# EAGLE design YM5214Emu (EAGLE 7.5.0)
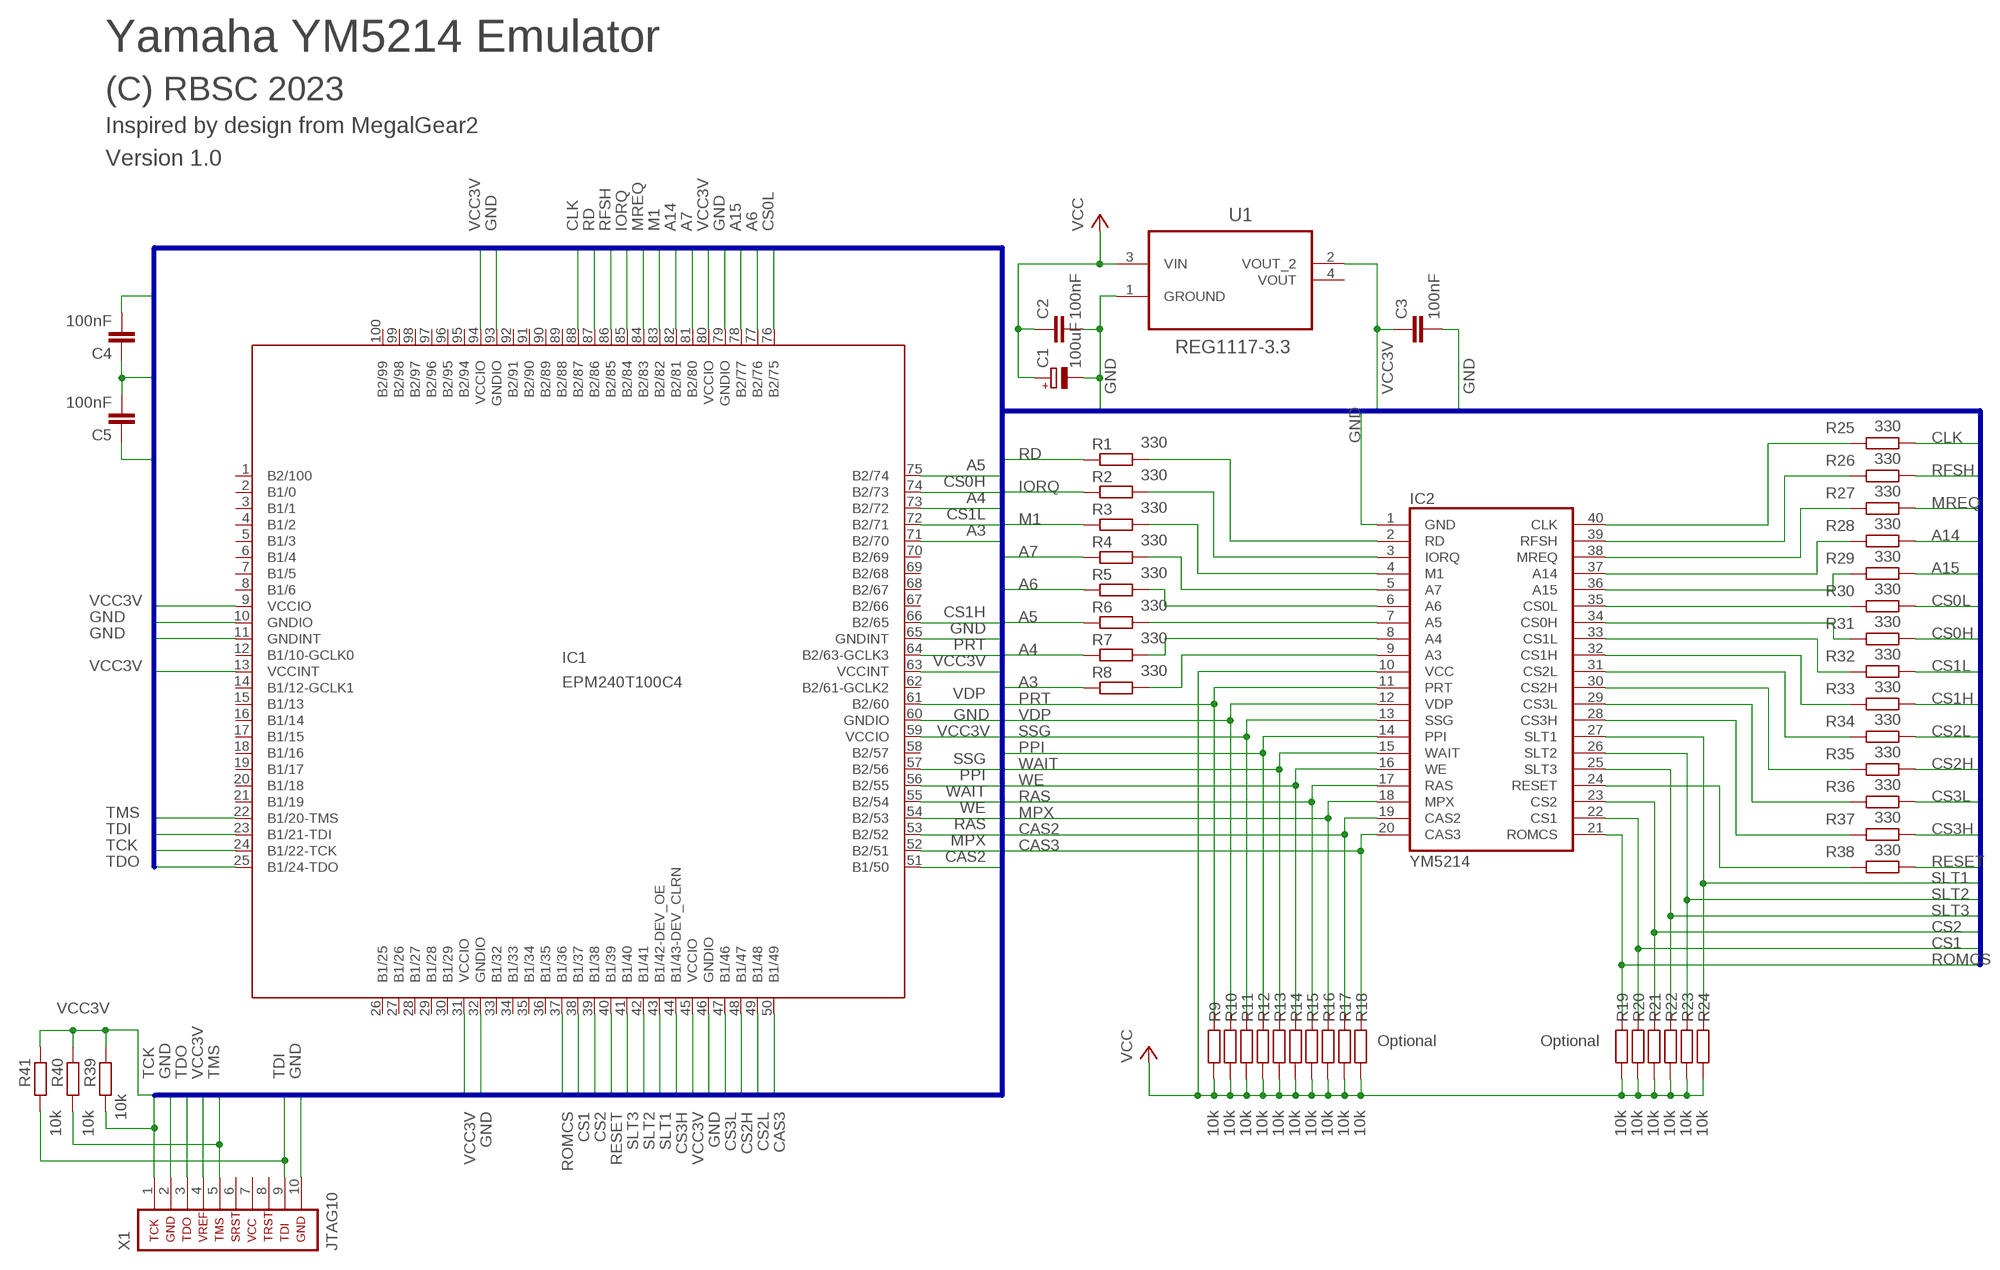
[diagram p0: schematic, sheet 1]

## Parts
C1  100uF  CPOL-EUSMCD  [SMC_D]
C2  100nF  C-EUC0805  [C0805]
C3  100nF  C-EUC0805  [C0805]
C4  100nF  C-EUC0805  [C0805]
C5  100nF  C-EUC0805  [C0805]
IC1  EPM240T100C4  [TQFP100]
IC2  YM5214  [DIL40]
R1  330  R-EU_R0805  [R0805]
R2  330  R-EU_R0805  [R0805]
R3  330  R-EU_R0805  [R0805]
R4  330  R-EU_R0805  [R0805]
R5  330  R-EU_R0805  [R0805]
R6  330  R-EU_R0805  [R0805]
R7  330  R-EU_R0805  [R0805]
R8  330  R-EU_R0805  [R0805]
R9  10k  R-EU_R0805  [R0805]
R10  10k  R-EU_R0805  [R0805]
R11  10k  R-EU_R0805  [R0805]
R12  10k  R-EU_R0805  [R0805]
R13  10k  R-EU_R0805  [R0805]
R14  10k  R-EU_R0805  [R0805]
R15  10k  R-EU_R0805  [R0805]
R16  10k  R-EU_R0805  [R0805]
R17  10k  R-EU_R0805  [R0805]
R18  10k  R-EU_R0805  [R0805]
R19  10k  R-EU_R0805  [R0805]
R20  10k  R-EU_R0805  [R0805]
R21  10k  R-EU_R0805  [R0805]
R22  10k  R-EU_R0805  [R0805]
R23  10k  R-EU_R0805  [R0805]
R24  10k  R-EU_R0805  [R0805]
R25  330  R-EU_R0805  [R0805]
R26  330  R-EU_R0805  [R0805]
R27  330  R-EU_R0805  [R0805]
R28  330  R-EU_R0805  [R0805]
R29  330  R-EU_R0805  [R0805]
R30  330  R-EU_R0805  [R0805]
R31  330  R-EU_R0805  [R0805]
R32  330  R-EU_R0805  [R0805]
R33  330  R-EU_R0805  [R0805]
R34  330  R-EU_R0805  [R0805]
R35  330  R-EU_R0805  [R0805]
R36  330  R-EU_R0805  [R0805]
R37  330  R-EU_R0805  [R0805]
R38  330  R-EU_R0805  [R0805]
R39  10k  R-EU_R0805  [R0805]
R40  10k  R-EU_R0805  [R0805]
R41  10k  R-EU_R0805  [R0805]
U1  REG1117-3.3  [SOT230P700X180-4N]
X1  JTAG10  [JTAG10]

## Nets
A3: IC1.71(B2/70) R8.1
A4: IC1.73(B2/72) R7.1
A5: IC1.75(B2/74) R6.1
A6: IC1.77(B2/76) R5.1
A7: IC1.81(B2/80) R4.1
A14: IC1.82(B2/81) R28.2
A15: IC1.78(B2/77) R29.2
CAS2: IC1.51(B1/50) IC2.19(CAS2) R17.2
CAS3: IC1.50(B1/49) IC2.20(CAS3) R18.2
CLK: IC1.88(B2/87) R25.2
CS0H: IC1.74(B2/73) R31.2
CS0L: IC1.76(B2/75) R30.2
CS1: IC1.38(B1/37) IC2.22(CS1) R20.2
CS1H: IC1.66(B2/65) R33.2
CS1L: IC1.72(B2/71) R32.2
CS2: IC1.39(B1/38) IC2.23(CS2) R21.2
CS2H: IC1.48(B1/47) R35.2
CS2L: IC1.49(B1/48) R34.2
CS3H: IC1.44(B1/43-DEV_CLRN) R37.2
CS3L: IC1.47(B1/46) R36.2
GND: C1.- C2.2 C3.2 C4.1 C5.2 IC1.10(GNDIO) IC1.11(GNDINT) IC1.32(GNDIO) IC1.46(GNDIO) IC1.60(GNDIO) IC1.65(GNDINT) IC1.79(GNDIO) IC1.93(GNDIO) IC2.1(GND) U1.1(GROUND) X1.2 X1.10
IORQ: IC1.85(B2/84) R2.1
M1: IC1.83(B2/82) R3.1
MPX: IC1.52(B2/51) IC2.18(MPX) R16.2
MREQ: IC1.84(B2/83) R27.2
N$1: IC2.2(RD) R1.2
N$2: IC2.3(IORQ) R2.2
N$3: IC2.4(M1) R3.2
N$5: IC2.5(A7) R4.2
N$6: IC2.6(A6) R5.2
N$7: IC2.7(A5) R6.2
N$8: IC2.8(A4) R7.2
N$9: IC2.9(A3) R8.2
N$10: IC2.24(RESET) R38.1
N$11: IC2.28(CS3H) R37.1
N$12: IC2.29(CS3L) R36.1
N$13: IC2.30(CS2H) R35.1
N$14: IC2.31(CS2L) R34.1
N$15: IC2.32(CS1H) R33.1
N$16: IC2.33(CS1L) R32.1
N$17: IC2.34(CS0H) R31.1
N$18: IC2.35(CS0L) R30.1
N$19: IC2.36(A15) R29.1
N$20: IC2.37(A14) R28.1
N$21: IC2.38(MREQ) R27.1
N$22: IC2.39(RFSH) R26.1
N$23: IC2.40(CLK) R25.1
PPI: IC1.56(B2/55) IC2.14(PPI) R12.2
PRT: IC1.64(B2/63-GCLK3) IC2.11(PRT) R9.2
RAS: IC1.53(B2/52) IC2.17(RAS) R15.2
RD: IC1.87(B2/86) R1.1
RESET: IC1.40(B1/39) R38.2
RFSH: IC1.86(B2/85) R26.2
ROMCS: IC1.37(B1/36) IC2.21(ROMCS) R19.2
SLT1: IC1.43(B1/42-DEV_OE) IC2.27(SLT1) R24.2
SLT2: IC1.42(B1/41) IC2.26(SLT2) R23.2
SLT3: IC1.41(B1/40) IC2.25(SLT3) R22.2
SSG: IC1.57(B2/56) IC2.13(SSG) R11.2
TCK: IC1.24(B1/22-TCK) R39.1 X1.1
TDI: IC1.23(B1/21-TDI) R41.1 X1.9
TDO: IC1.25(B1/24-TDO) X1.3
TMS: IC1.22(B1/20-TMS) R40.1 X1.5
VCC: C1.+ C2.1 IC2.10(VCC) R9.1 R10.1 R11.1 R12.1 R13.1 R14.1 R15.1 R16.1 R17.1 R18.1 R19.1 R20.1 R21.1 R22.1 R23.1 R24.1 U1.3(VIN)
VCC3V: C3.1 C4.2 C5.1 IC1.9(VCCIO) IC1.13(VCCINT) IC1.31(VCCIO) IC1.45(VCCIO) IC1.59(VCCIO) IC1.63(VCCINT) IC1.80(VCCIO) IC1.94(VCCIO) R39.2 R40.2 R41.2 U1.2(VOUT_2) X1.4
VDP: IC1.61(B2/60) IC2.12(VDP) R10.2
WAIT: IC1.55(B2/54) IC2.15(WAIT) R13.2
WE: IC1.54(B2/53) IC2.16(WE) R14.2
Unconnected: IC1.1(B2/100) IC1.2(B1/0) IC1.3(B1/1) IC1.4(B1/2) IC1.5(B1/3) IC1.6(B1/4) IC1.7(B1/5) IC1.8(B1/6) IC1.12(B1/10-GCLK0) IC1.14(B1/12-GCLK1) IC1.15(B1/13) IC1.16(B1/14) IC1.17(B1/15) IC1.18(B1/16) IC1.19(B1/17) IC1.20(B1/18) IC1.21(B1/19) IC1.26(B1/25) IC1.27(B1/26) IC1.28(B1/27) IC1.29(B1/28) IC1.30(B1/29) IC1.33(B1/32) IC1.34(B1/33) IC1.35(B1/34) IC1.36(B1/35) IC1.58(B2/57) IC1.62(B2/61-GCLK2) IC1.67(B2/66) IC1.68(B2/67) IC1.69(B2/68) IC1.70(B2/69) IC1.89(B2/88) IC1.90(B2/89) IC1.91(B2/90) IC1.92(B2/91) IC1.95(B2/94) IC1.96(B2/95) IC1.97(B2/96) IC1.98(B2/97) IC1.99(B2/98) IC1.100(B2/99) U1.4(VOUT) X1.6 X1.7 X1.8

## Buses
RD,IORQ,M1,A7,A6,A5,A4,A3,CLK,RFSH,MREQ,A14,A15,CS0L,CS0H,CS1L,CS1H,CS2L,CS2H,CS3L,CS3H,RESET,VCC3V,GND,VCC,TMS,TDO,TDI,TCK,PRT,VDP,SSG,PPI,WAIT,WE,RAS,MPX,CAS2,CAS3,ROMCS,CS1,CS2,SLT1,SLT2,SLT3

## Notes on the sheet
- Yamaha YM5214 Emulator
- (C) RBSC 2023
- Inspired by design from MegalGear2
- Version 1.0
- Optional | Optional

## Library data of the parts
C1 = resistor:CPOL-EU: POLARIZED CAPACITOR, European symbol
C2-C5 = rcl:C-EU: CAPACITOR, European symbol
IC1 = altera:EPM240T100C4: EPM240T100 Low-cost, low-power CPLD Auto generated by make-symbol-device-package-bsdl.ulp Rev. 35 Source: www.altera.com .. epm240-io.txt; MPN: EPM240T100C4; OC_FARNELL: 1453502; OC_NEWARK: 51R9357
IC2 = ym5214:YM5214: YM5214
R1-R41 = rcl:R-EU_: RESISTOR, European symbol
U1 = Texas Instruments_By_element14_Batch_1:REG1117-3.3: Low Dropout Positive Regulator; MPN: REG1117-3.3; OC_FARNELL: 1212355; OC_NEWARK: 35C1963; PACKAGE: SOT-223-4; SUPPLIER: Texas Instruments
X1 = JTAG:JTAG10: AVR JTAG Debug/Programming Header

## Board
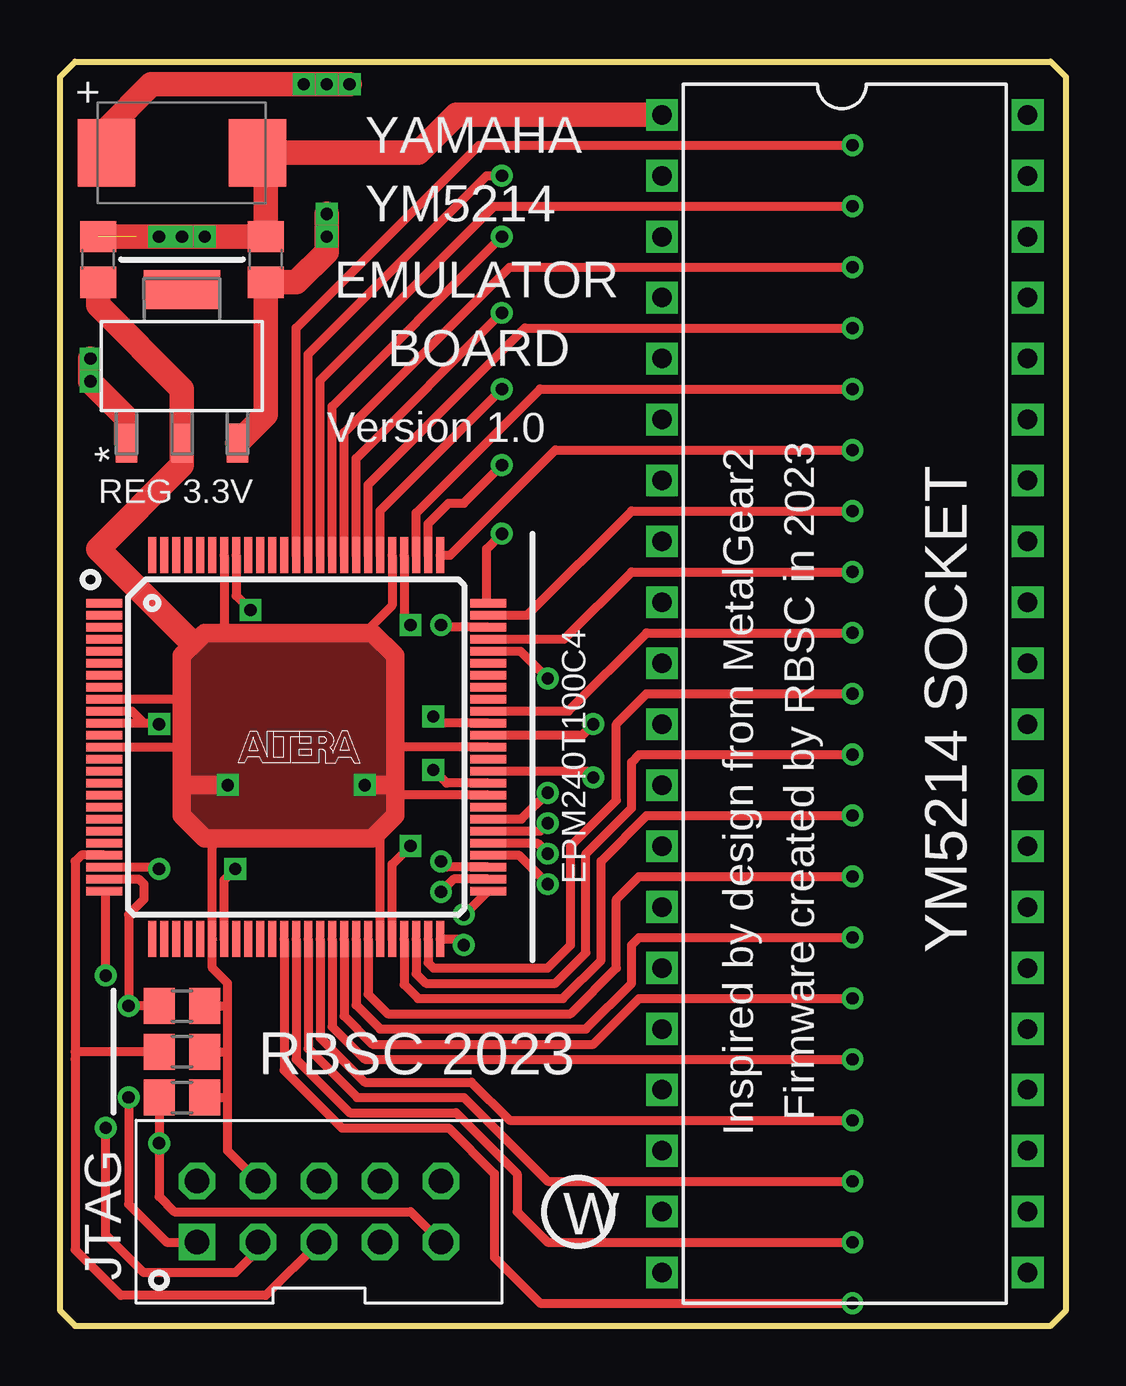
[diagram p1: board, top side]
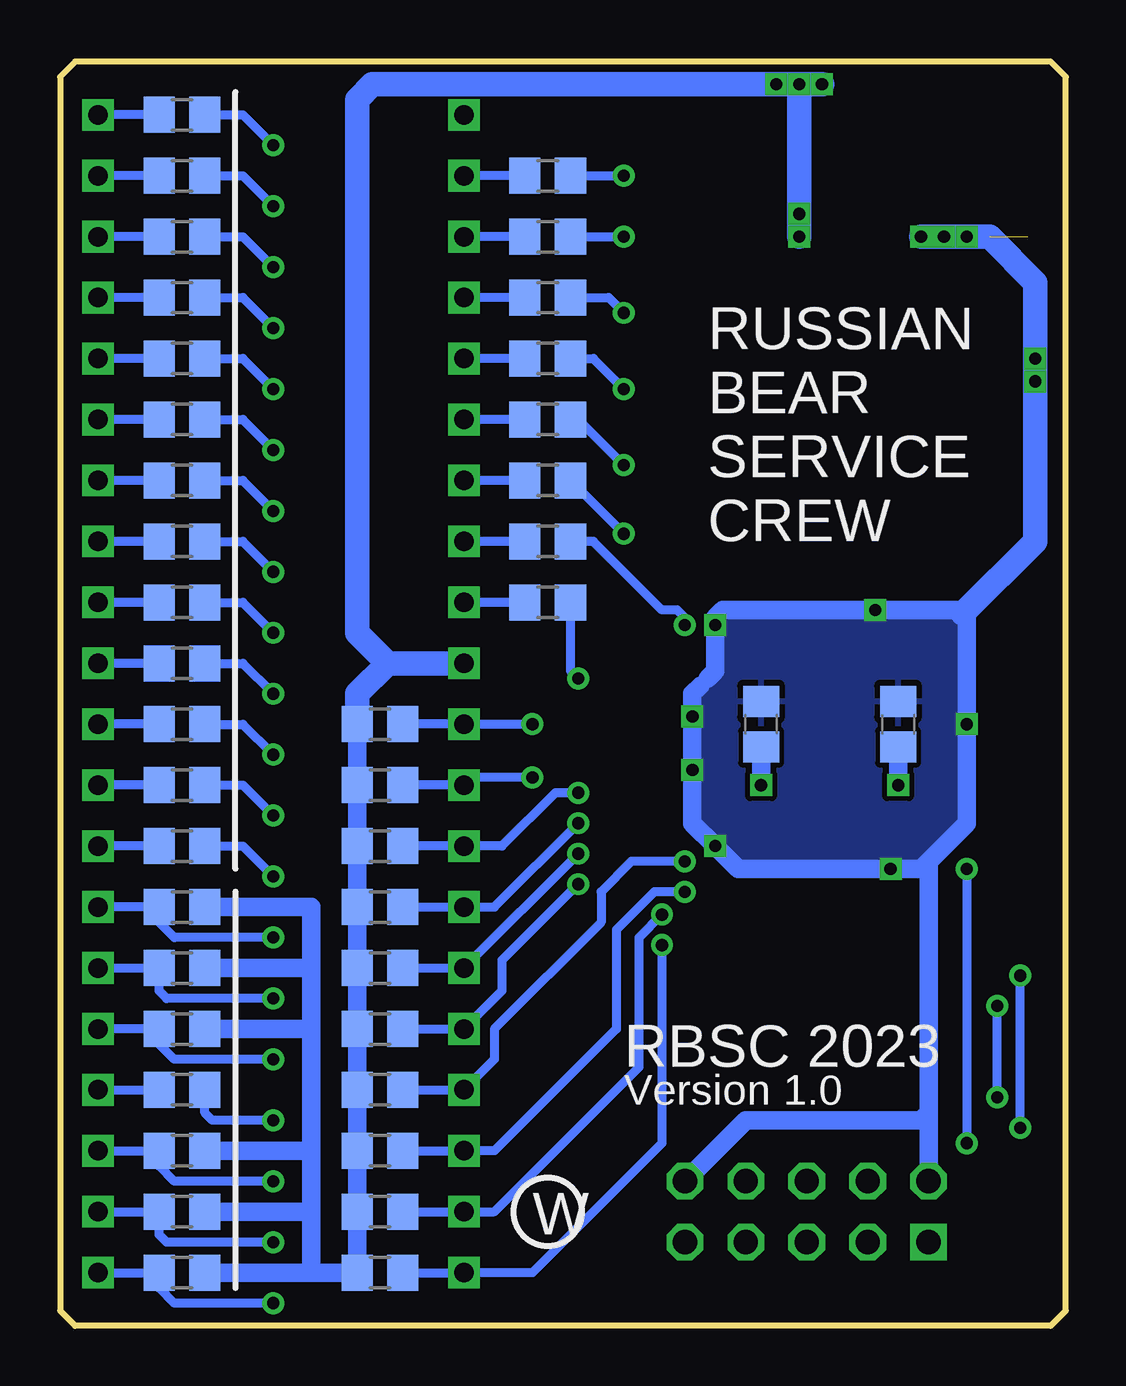
[diagram p2: board, bottom side, seen from below]

Size 41.91 x 52.7 mm. Coordinates in mm from the lower left corner, seen from the top.
Outline: 0,0.64 0,52.07 0.64,52.7 41.27,52.7 41.91,52.07 41.91,0.64 41.27,0 0.64,0 0,0.64
Copper layers (1*16): Top 0.035mm / dielectric 1.5mm / Bottom 0.035mm
Design rules "default *": minimum track width 10mil, minimum drill 24mil, track to track 8mil, track to pad 8mil, pad to pad 8mil, via to via 8mil, smd to smd 8mil, copper to edge 8mil, drill to drill 8mil, minimum pad ring 10mil, minimum via ring 8mil, stop-mask expansion 4mil, vias tented up to drill 24mil, thermal gap 10mil

### Footprints (pad centres in the part's own frame; a part is rotated, then mirrored left to right if it is on the bottom)
SMC_D = smd 2.4 x 2.8: + -3.15,0; - 3.15,0
C0805 = smd 1.3 x 1.5: 1 -0.95,0; 2 0.95,0
TQFP100 = smd 1.5 x 0.35: 1 -8,6; 2 -8,5.5; 3 -8,5; 4 -8,4.5; 5 -8,4; 6 -8,3.5; 7 -8,3; 8 -8,2.5; 9 -8,2; 10 -8,1.5; 11 -8,1; 12 -8,0.5; 13 -8,0; 14 -8,-0.5; 15 -8,-1; 16 -8,-1.5; 17 -8,-2; 18 -8,-2.5; 19 -8,-3; 20 -8,-3.5; 21 -8,-4; 22 -8,-4.5; 23 -8,-5; 24 -8,-5.5; 25 -8,-6; 51 8,-6; 52 8,-5.5; 53 8,-5; 54 8,-4.5; 55 8,-4; 56 8,-3.5; 57 8,-3; 58 8,-2.5; 59 8,-2; 60 8,-1.5; 61 8,-1; 62 8,-0.5; 63 8,0; 64 8,0.5; 65 8,1; 66 8,1.5; 67 8,2; 68 8,2.5; 69 8,3; 70 8,3.5; 71 8,4; 72 8,4.5; 73 8,5; 74 8,5.5; 75 8,6 | smd 0.35 x 1.5: 26 -6,-8; 27 -5.5,-8; 28 -5,-8; 29 -4.5,-8; 30 -4,-8; 31 -3.5,-8; 32 -3,-8; 33 -2.5,-8; 34 -2,-8; 35 -1.5,-8; 36 -1,-8; 37 -0.5,-8; 38 0,-8; 39 0.5,-8; 40 1,-8; 41 1.5,-8; 42 2,-8; 43 2.5,-8; 44 3,-8; 45 3.5,-8; 46 4,-8; 47 4.5,-8; 48 5,-8; 49 5.5,-8; 50 6,-8; 76 6,8; 77 5.5,8; 78 5,8; 79 4.5,8; 80 4,8; 81 3.5,8; 82 3,8; 83 2.5,8; 84 2,8; 85 1.5,8; 86 1,8; 87 0.5,8; 88 0,8; 89 -0.5,8; 90 -1,8; 91 -1.5,8; 92 -2,8; 93 -2.5,8; 94 -3,8; 95 -3.5,8; 96 -4,8; 97 -4.5,8; 98 -5,8; 99 -5.5,8; 100 -6,8
DIL40 = drill 0.813 square: 1 -24.13,-7.62; 2 -21.59,-7.62; 3 -19.05,-7.62; 4 -16.51,-7.62; 5 -13.97,-7.62; 6 -11.43,-7.62; 7 -8.89,-7.62; 8 -6.35,-7.62; 9 -3.81,-7.62; 10 -1.27,-7.62; 11 1.27,-7.62; 12 3.81,-7.62; 13 6.35,-7.62; 14 8.89,-7.62; 15 11.43,-7.62; 16 13.97,-7.62; 17 16.51,-7.62; 18 19.05,-7.62; 19 21.59,-7.62; 20 24.13,-7.62; 21 24.13,7.62; 22 21.59,7.62; 23 19.05,7.62; 24 16.51,7.62; 25 13.97,7.62; 26 11.43,7.62; 27 8.89,7.62; 28 6.35,7.62; 29 3.81,7.62; 30 1.27,7.62; 31 -1.27,7.62; 32 -3.81,7.62; 33 -6.35,7.62; 34 -8.89,7.62; 35 -11.43,7.62; 36 -13.97,7.62; 37 -16.51,7.62; 38 -19.05,7.62; 39 -21.59,7.62; 40 -24.13,7.62
R0805 = smd 1.3 x 1.5: 1 -0.95,0; 2 0.95,0
SOT230P700X180-4N = smd 1.626 x 0.889: 1 -3.2,2.311; 2 -3.2,0; 3 -3.2,-2.311 | smd 1.626 x 3.175: 4 3.2,0
JTAG10 = drill 1.016 square: 1 -5.08,-1.27 | drill 1.016 octagon: 2 -5.08,1.27; 3 -2.54,-1.27; 4 -2.54,1.27; 5 0,-1.27; 6 0,1.27; 7 2.54,-1.27; 8 2.54,1.27; 9 5.08,-1.27; 10 5.08,1.27

### Placement (x,y rotation side)
C1  5.08,48.9 0 top
C2  8.57,44.45 90 top
C3  1.59,44.45 90 top
C4  6.99,25.08 270 bottom
C5  12.7,25.08 90 bottom
IC1  9.84,24.13 0 top
IC2  32.7,26.35 270 top
R1  21.59,47.94 180 bottom
R2  21.59,45.4 180 bottom
R3  21.59,42.86 180 bottom
R4  21.59,40.32 180 bottom
R5  21.59,37.78 180 bottom
R6  21.59,35.24 180 bottom
R7  21.59,32.7 180 bottom
R8  21.59,30.16 180 bottom
R9  28.57,25.08 0 bottom
R10  28.57,22.54 0 bottom
R11  28.57,20 0 bottom
R12  28.57,17.46 0 bottom
R13  28.57,14.92 0 bottom
R14  28.57,12.38 0 bottom
R15  28.57,9.84 0 bottom
R16  28.57,7.3 0 bottom
R17  28.57,4.76 0 bottom
R18  28.57,2.22 0 bottom
R19  36.83,2.22 180 bottom
R20  36.83,4.76 180 bottom
R21  36.83,7.3 180 bottom
R22  36.83,12.38 180 bottom
R23  36.83,14.92 180 bottom
R24  36.83,17.46 180 bottom
R25  36.83,50.48 0 bottom
R26  36.83,47.94 0 bottom
R27  36.83,45.4 0 bottom
R28  36.83,42.86 0 bottom
R29  36.83,40.32 0 bottom
R30  36.83,37.78 0 bottom
R31  36.83,35.24 0 bottom
R32  36.83,32.7 0 bottom
R33  36.83,30.16 0 bottom
R34  36.83,27.62 0 bottom
R35  36.83,25.08 0 bottom
R36  36.83,22.54 0 bottom
R37  36.83,20 0 bottom
R38  36.83,9.84 0 bottom
R39  5.08,13.34 0 top
R40  5.08,11.43 0 top
R41  5.08,9.53 0 top
U1  5.08,40.01 90 top
X1  10.79,4.76 0 top

### Tracks (layer width: path | path; a pad name or v marks a point on that pad's centre or on a via)
A3  (via drill 0.51)
  Top 0.381: IC1.71 19.18,28.13 v20.32,26.99
  Bottom 0.381: R8.1 20.64,27.31 v20.32,26.99
A4  (via drill 0.51)
  Top 0.381: IC1.73 15.96,29.13 v15.88,29.21
  Bottom 0.381: v15.88,29.21 15.88,29.53 16.19,29.84 16.83,29.84 19.68,32.7 R7.1
A5  (via drill 0.51)
  Top 0.381: IC1.75 17.78,30.19 17.78,32.38 v18.41,33.02
  Bottom 0.381: R6.1 v18.41,33.02
A6  (via drill 0.51)
  Top 0.381: IC1.77 15.34,33.44 16.19,34.29 16.83,34.29 v18.41,35.88
  Bottom 0.381: R5.1 20.32,37.78 v18.41,35.88
A7  (via drill 0.51)
  Top 0.381: IC1.81 13.34,33.98 v18.41,39.05
  Bottom 0.381: R4.1 19.68,40.32 v18.41,39.05
A14  (via drill 0.51)
  Top 0.381: IC1.82 12.84,35.07 19.37,41.59 v33.02,41.59
  Bottom 0.381: R28.2 34.29,42.86 v33.02,41.59
A15  (via drill 0.51)
  Top 0.381: IC1.78 14.84,33.89 20,39.05 v33.02,39.05
  Bottom 0.381: R29.2 34.29,40.32 v33.02,39.05
CAS2  (via drill 0.51)
  Top 0.381: v16.83,17.14 16.86,17.14 IC1.51
  Bottom 0.381: R17.2 IC2.19 23.81,4.76 17.78,10.79 17.78,16.19 v16.83,17.14
CAS3  (via drill 0.51)
  Top 0.381: IC1.50 16.57,16.13 v16.83,15.88
  Bottom 0.381: R18.2 IC2.20 22.23,2.22 16.83,7.62 v16.83,15.88
CLK  (via drill 0.51)
  Top 0.381: IC1.88 9.84,41.59 17.46,49.21 v33.02,49.21
  Bottom 0.381: R25.2 34.29,50.48 v33.02,49.21
CS0H  (via drill 0.51)
  Top 0.381: IC1.74 19.47,29.63 23.81,33.97 v33.02,33.97
  Bottom 0.381: R31.2 34.29,35.24 v33.02,33.97
CS0L  (via drill 0.51)
  Top 0.381: IC1.76 16.25,32.13 20.64,36.51 v33.02,36.51
  Bottom 0.381: R30.2 34.29,37.78 v33.02,36.51
CS1  (via drill 0.51)
  Top 0.381: IC1.38 9.84,11.11 12.06,8.89 16.51,8.89 19.05,6.35 19.05,4.76 20.32,3.49 v33.02,3.49
  Bottom 0.381: IC2.22 R20.2 37.78,3.81 37.47,3.49 v33.02,3.49
CS1H  (via drill 0.51)
  Top 0.381: IC1.66 21.18,25.63 24.45,28.89 v33.02,28.89
  Bottom 0.381: R33.2 34.29,30.16 v33.02,28.89
CS1L  (via drill 0.51)
  Top 0.381: IC1.72 21.01,28.63 23.81,31.43 v33.02,31.43
  Bottom 0.381: R32.2 34.29,32.7 v33.02,31.43
CS2  (via drill 0.51)
  Top 0.381: IC1.39 10.34,11.56 12.38,9.53 16.83,9.53 20.32,6.03 v33.02,6.03
  Bottom 0.381: IC2.23 R21.2 37.78,6.67 37.15,6.03 v33.02,6.03
CS2H  (via drill 0.51)
  Top 0.381: IC1.48 14.84,14.69 15.24,14.29 20.64,14.29 21.91,15.56 21.91,19.68 23.81,21.59 23.81,23.5 24.13,23.81 v33.02,23.81
  Bottom 0.381: R35.2 34.29,25.08 v33.02,23.81
CS2L  (via drill 0.51)
  Top 0.381: IC1.49 15.34,15.14 15.56,14.92 20.32,14.92 21.27,15.88 21.27,20 23.18,21.91 23.18,25.08 24.45,26.35 v33.02,26.35
  Bottom 0.381: R34.2 34.29,27.62 v33.02,26.35
CS3H  (via drill 0.51)
  Top 0.381: IC1.44 12.84,13.83 13.65,13.02 21.27,13.02 23.18,14.92 23.18,17.78 24.13,18.73 v33.02,18.73
  Bottom 0.381: R37.2 34.29,20 v33.02,18.73
CS3L  (via drill 0.51)
  Top 0.381: IC1.47 14.34,14.23 14.92,13.65 20.95,13.65 22.54,15.24 22.54,19.37 24.45,21.27 v33.02,21.27
  Bottom 0.381: R36.2 34.29,22.54 v33.02,21.27
GND  (via drill 0.51)  (1 unrouted)
  Top 0.381: IC1.11 3.49,25.13 | 3.49,25.13 4.08,25.13 v4.13,25.08 | IC1.93 7.34,30.44 v7.94,29.84 | IC1.79 14.34,29.47 v14.61,29.21 | IC1.46 13.84,19.24 v14.61,20 | IC1.32 6.84,18.59 v7.3,19.05 | IC1.10 2.99,25.63 3.49,25.13 | IC1.60 16.11,22.63 v15.56,23.18 | IC1.65 15.83,25.13 v15.56,25.4
  Top 1.016: IC2.1 16.51,50.48 14.92,48.9 C1.- 8.57,48.55 C2.2 C3.2 | U1.1 2.77,37.87 v1.27,39.37 v1.27,40.32
  Bottom 0.381: C5.2
  Bottom 0.762: X1.2 5.71,8.89 | 5.71,8.89 5.71,19.37 | 5.71,19.37 4.13,20.95 v4.13,25.08 4.13,29.53 4.29,29.69 4.45,29.84 v7.94,29.84 14.29,29.84 14.61,29.53 v14.61,29.21 14.61,27.3 14.92,26.99 | 15.24,26.67 15.56,26.35 v15.56,25.4 v15.56,23.18 15.56,20.95 v14.61,20 13.65,19.05 v7.3,19.05 6.03,19.05 5.71,19.37 | X1.10 13.34,8.57 6.03,8.57 5.71,8.89
  Bottom 1.016: 4.29,29.69 1.27,32.7 v1.27,39.37 v1.27,40.32 1.27,43.49 3.17,45.4 6.03,45.4
  pour Bottom: 4.45,29.53 14.61,29.53 14.61,26.67 15.24,26.67 15.24,20.64 14.92,20.64 14.92,20.32 14.61,20.32 14.61,20 14.29,20 14.29,19.37 13.65,19.37 13.65,19.05 5.71,19.05 5.71,19.68 5.08,19.68 5.08,20 4.76,20 4.76,20.64 4.45,20.64
IORQ  (via drill 0.51)
  Top 0.381: IC1.85 11.34,38.33 v18.41,45.4
  Bottom 0.381: R2.1 v18.41,45.4
M1  (via drill 0.51)
  Top 0.381: IC1.83 12.34,36.16 v18.41,42.23
  Bottom 0.381: R3.1 19.05,42.86 v18.41,42.23
MPX  (via drill 0.51)
  Top 0.381: IC1.52 16.41,18.63 v15.88,18.1
  Bottom 0.381: R16.2 IC2.18 23.81,7.3 18.73,12.38 18.73,16.51 17.14,18.1 v15.88,18.1
MREQ  (via drill 0.51)
  Top 0.381: IC1.84 11.84,37.24 18.73,44.13 v33.02,44.13
  Bottom 0.381: R27.2 34.29,45.4 v33.02,44.13
N$1
  Bottom 0.381: R1.2 IC2.2
N$2
  Bottom 0.381: R2.2 IC2.3
N$3
  Bottom 0.381: R3.2 IC2.4
N$5
  Bottom 0.381: R4.2 IC2.5
N$6
  Bottom 0.381: R5.2 IC2.6
N$7
  Bottom 0.381: R6.2 IC2.7
N$8
  Bottom 0.381: R7.2 IC2.8
N$9
  Bottom 0.381: R8.2 IC2.9
N$10
  Bottom 0.381: IC2.24 R38.1
N$11
  Bottom 0.381: R37.1 IC2.28
N$12
  Bottom 0.381: R36.1 IC2.29
N$13
  Bottom 0.381: R35.1 IC2.30
N$14
  Bottom 0.381: R34.1 IC2.31
N$15
  Bottom 0.381: R33.1 IC2.32
N$16
  Bottom 0.381: R32.1 IC2.33
N$17
  Bottom 0.381: R31.1 IC2.34
N$18
  Bottom 0.381: R30.1 IC2.35
N$19
  Bottom 0.381: R29.1 IC2.36
N$20
  Bottom 0.381: R28.1 IC2.37
N$21
  Bottom 0.381: R27.1 IC2.38
N$22
  Bottom 0.381: R26.1 IC2.39
N$23
  Bottom 0.381: R25.1 IC2.40
N$24  (via drill 0.51)
  other vias: 6.03,45.4
N$25  (via drill 0.51)
  other vias: 4.13,45.4
N$26  (via drill 0.51)
  other vias: 5.08,45.4
PPI  (via drill 0.51)
  Top 0.381: IC1.56 20,20.63 v20.32,20.95
  Bottom 0.381: R12.2 IC2.14 23.81,17.46 v20.32,20.95
PRT  (via drill 0.51)
  Top 0.381: IC1.64 21.77,24.63 v22.23,25.08
  Bottom 0.381: R9.2 IC2.11 v22.23,25.08
RAS  (via drill 0.51)
  Top 0.381: IC1.53 16.11,19.13 v15.88,19.37
  Bottom 0.381: R15.2 IC2.17 23.81,11.11 23.81,12.38 19.37,16.83 19.37,18.1 18.1,19.37 v15.88,19.37
RD  (via drill 0.51)
  Top 0.381: IC1.87 10.34,40.51 17.78,47.94 v18.41,47.94
  Bottom 0.381: R1.1 v18.41,47.94
RESET  (via drill 0.51)
  Top 0.381: IC1.40 10.84,12.02 12.7,10.16 17.14,10.16 18.73,8.57 v33.02,8.57
  Bottom 0.381: v33.02,8.57 35.56,8.57 35.88,8.89 R38.2
RFSH  (via drill 0.51)
  Top 0.381: IC1.86 10.84,39.42 18.1,46.67 v33.02,46.67
  Bottom 0.381: R26.2 34.29,47.94 v33.02,46.67
ROMCS  (via drill 0.51)
  Top 0.381: IC1.37 9.34,10.66 11.75,8.26 16.19,8.26 18.1,6.35 18.1,2.86 20,0.95 v33.02,0.95
  Bottom 0.381: IC2.21 R19.2 37.78,1.59 37.15,0.95 v33.02,0.95
SLT1  (via drill 0.51)
  Top 0.381: IC1.43 12.34,13.38 13.34,12.38 21.91,12.38 23.81,14.29 23.81,15.88 24.13,16.19 v33.02,16.19
  Bottom 0.381: IC2.27 R24.2 37.78,16.83 37.15,16.19 v33.02,16.19
SLT2  (via drill 0.51)
  Top 0.381: IC1.42 11.84,12.92 13.02,11.75 22.23,11.75 24.13,13.65 v33.02,13.65
  Bottom 0.381: IC2.26 R23.2 37.78,13.97 37.47,13.65 v33.02,13.65
SLT3  (via drill 0.51)
  Top 0.381: IC1.41 11.34,12.47 12.7,11.11 v33.02,11.11
  Bottom 0.381: IC2.25 R22.2 37.78,11.75 37.15,11.11 v33.02,11.11
SSG  (via drill 0.51)
  Top 0.381: IC1.57 19.23,21.13 v20.32,22.23
  Bottom 0.381: R11.2 IC2.13 23.5,20 21.27,22.23 v20.32,22.23
TCK  (via drill 0.51)
  Top 0.381: IC1.24 3.28,18.63 3.49,18.41 3.49,17.78 2.86,17.14 v2.86,13.34 R39.1 | v2.86,9.53 2.86,5.08 4.45,3.49 X1.1
  Bottom 0.381: v2.86,9.53 v2.86,13.34
TDI  (via drill 0.51)
  Top 0.381: IC1.23 4.05,19.13 v4.13,19.05 | R41.1 v4.13,7.62 4.13,5.4 4.76,4.76 14.61,4.76 X1.9
  Bottom 0.381: v4.13,19.05 v4.13,7.62
TDO  (via drill 0.51)
  Top 0.381: v1.91,8.26 1.91,3.81 3.49,2.22 7.3,2.22 8.26,3.17 X1.3 | v1.91,14.61 1.91,18.07 IC1.25
  Bottom 0.381: v1.91,8.26 v1.91,14.61
TMS
  Top 0.381: IC1.22 0.9,19.63 0.64,19.37 0.64,11.43 | X1.5 8.57,1.27 2.54,1.27 0.64,3.17 0.64,11.11 0.64,11.43 | R40.1 0.64,11.43
VCC  (via drill 0.51)
  Top 1.016: U1.3 8.57,37.99 C2.1 9.85,43.5 11.11,44.77 v11.11,45.4 v11.11,46.35 | C1.+ 1.93,49.87 3.81,51.75 v10.16,51.75 v11.11,51.75 v12.06,51.75
  Bottom 0.762: R9.1 R10.1 R11.1 R12.1 R13.1 R14.1 R15.1 R16.1 R17.1 R18.1 31.43,2.22 | R22.1 31.43,12.38 | R21.1 31.43,7.3 | 31.43,14.92 31.43,12.38 | 31.43,12.38 31.43,7.3 | 31.43,7.3 31.43,4.76 | R19.1 31.43,2.22 | 31.43,2.22 31.43,4.76 | R20.1 31.43,4.76 | R24.1 31.43,17.46 31.43,14.92 | R23.1 31.43,14.92
  Bottom 1.016: R9.1 29.53,26.35 28.26,27.62 | v11.11,45.4 v11.11,46.35 v11.11,51.75 | v11.11,51.75 v12.06,51.75 | v11.11,51.75 28.89,51.75 29.53,51.12 29.53,28.89 28.26,27.62 | v11.11,51.75 v10.16,51.75 | IC2.10 28.26,27.62
VCC3V  (via drill 0.51)
  Top 0.381: IC1.13 5.08,24.13 | IC1.94 6.84,29.07 6.67,28.89 | 6.67,20.32 6.34,20 IC1.31 6.35,14.92 6.99,14.29 6.99,13.34 | IC1.45 13.34,20.31 13.18,20.48 | IC1.80 13.84,30.04 12.7,28.89 | IC1.9 4.99,26.13 5.08,26.04 | IC1.59 14.06,22.13 13.97,22.23 | 5.71,28.57 5.4,28.57 | 6.99,9.53 6.99,7.3 X1.4 | 6.99,9.53 6.99,11.43 | 6.99,11.43 6.99,13.34 | IC1.63 13.97,24.13 | R39.2 6.99,13.34 | R40.2 6.99,11.43 | R41.2 6.99,9.53
  Top 0.762: v12.7,22.54 13.97,22.54 | v6.99,22.54 5.08,22.54 | 5.08,22.54 5.08,24.13 5.08,26.04 5.08,27.94 5.71,28.57 6.03,28.89 6.67,28.89 12.7,28.89 13.02,28.89 13.97,27.94 13.97,24.13 13.97,22.54 | 5.08,22.54 5.08,21.27 6.03,20.32 6.67,20.32 13.02,20.32 13.18,20.48 13.97,21.27 13.97,22.23 13.97,22.54
  Top 1.016: 5.4,28.57 1.59,32.38 5.08,35.88 U1.2 5.08,39.05 1.59,42.55 C3.1
  Bottom 0.762: C5.1 v12.7,22.54 | C4.2 v6.99,22.54
  pour Top: 5.4,28.57 13.65,28.57 13.65,20.64 5.4,20.64
VDP  (via drill 0.51)
  Top 0.381: IC1.61 21.95,23.13 v22.23,22.86
  Bottom 0.381: R10.2 IC2.12 24.77,22.86 v22.23,22.86
WAIT  (via drill 0.51)
  Top 0.381: IC1.55 19.88,20.13 v20.32,19.68
  Bottom 0.381: R13.2 IC2.15 v20.32,19.68
WE  (via drill 0.51)
  Top 0.381: IC1.54 19.11,19.63 v20.32,18.41
  Bottom 0.381: R14.2 IC2.16 23.5,13.97 23.5,15.24 v20.32,18.41

### Text on the board
tNames: + | YAMAHA | YM5214 | EMULATOR | BOARD | Version 1.0 | REG 3.3V | EPM240T100C4 | YM5214 SOCKET | RBSC 2023 | Firmware created by RBSC in 2023 | Inspired by design from MetalGear2 | W | JTAG
bNames: RUSSIAN / BEAR / SERVICE / CREW | RBSC 2023 | Version 1.0 | W